# EAGLE design CFA (EAGLE 9.4.2)
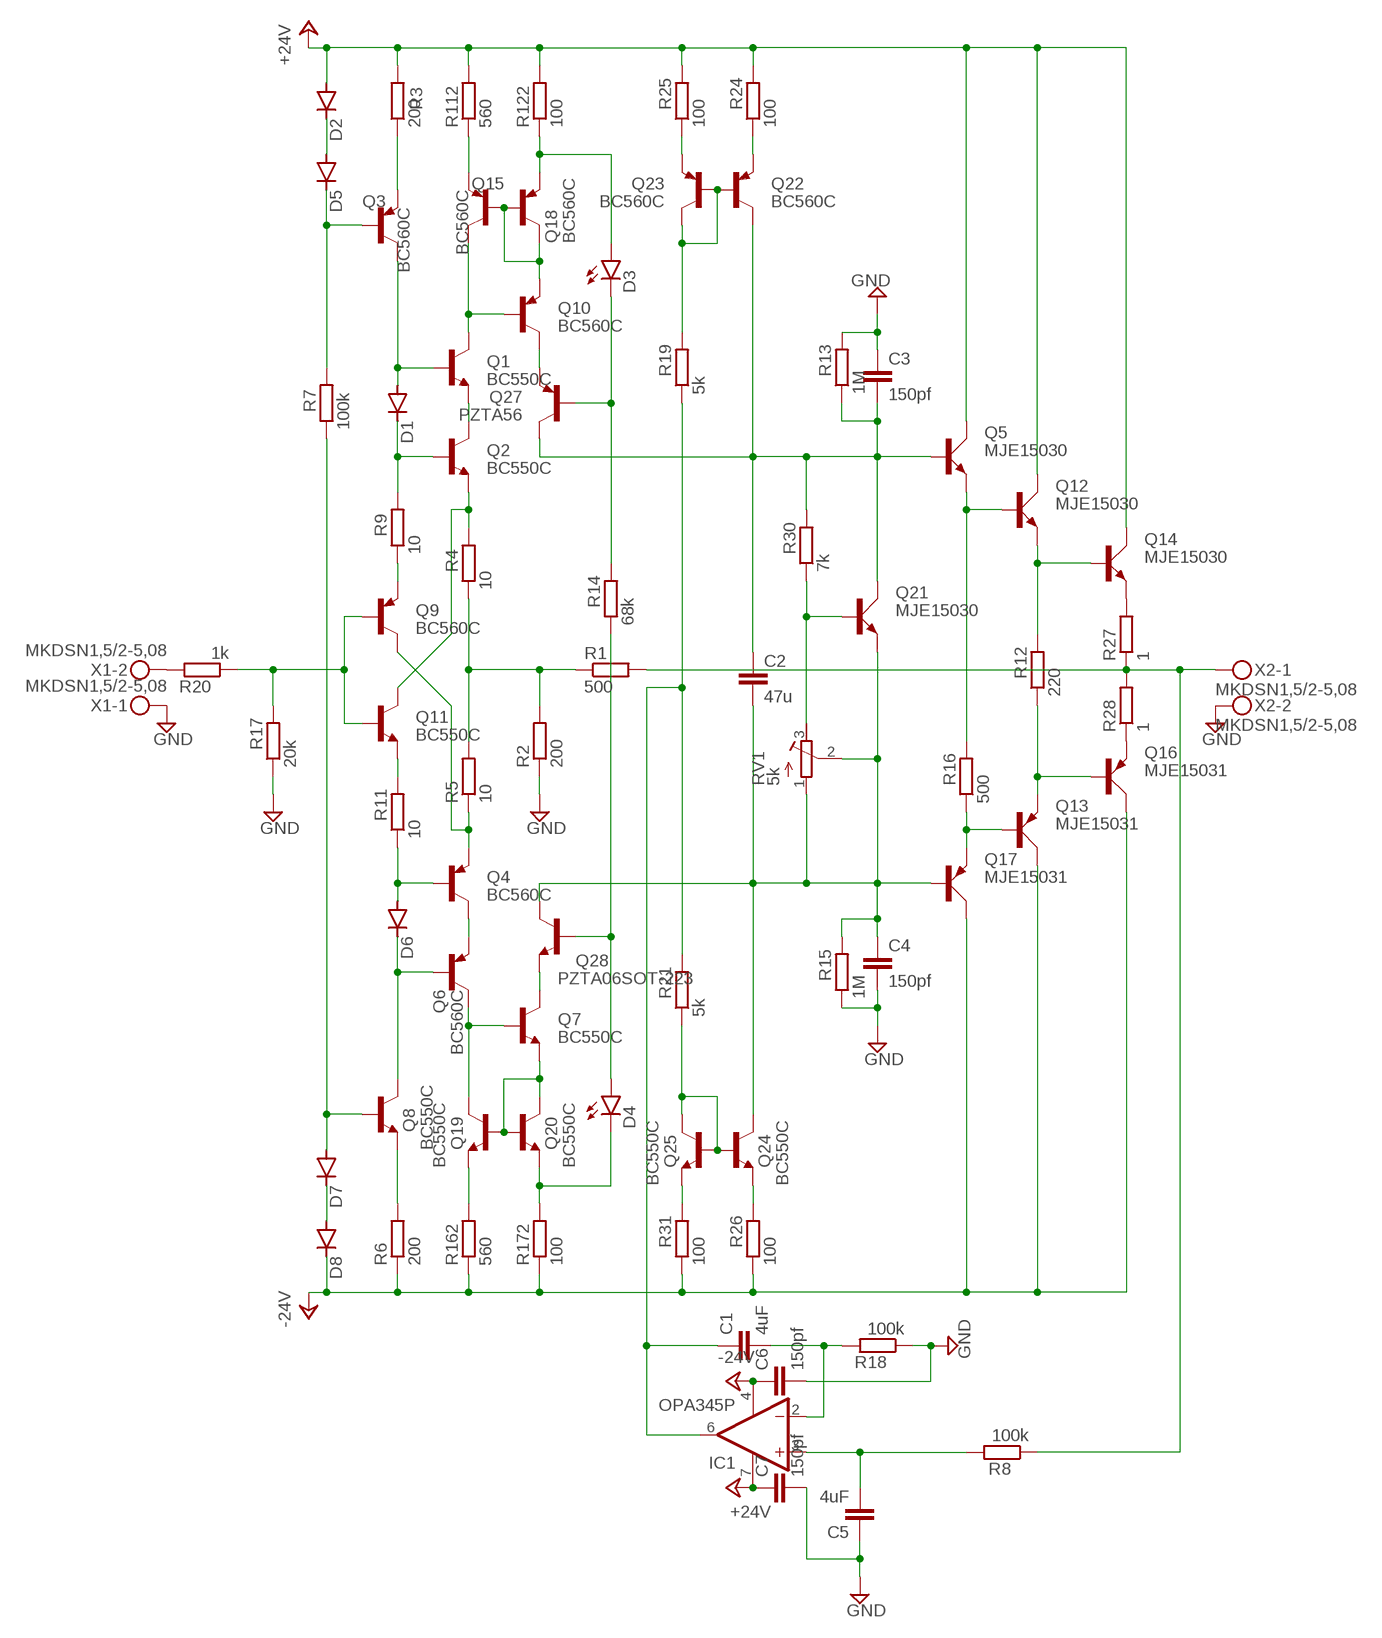
[diagram p0: schematic, sheet 1]

## Parts
C1  4uF  C-EUC1210  [C1210]
C2  47u  C-EUC1210  [C1210]
C3  150pf  C-EUC0805  [C0805]
C4  150pf  C-EUC0805  [C0805]
C5  4uF  C-EUC1210  [C1210]
C6  150pf  C-EUC0805  [C0805]
C7  150pf  C-EUC0805  [C0805]
D1  DIODE-SOD80C  [SOD80C]
D2  DIODE-SOD80C  [SOD80C]
D3  LED5MM  [LED5MM]
D4  LED5MM  [LED5MM]
D5  DIODE-SOD80C  [SOD80C]
D6  DIODE-SOD80C  [SOD80C]
D7  DIODE-SOD80C  [SOD80C]
D8  DIODE-SOD80C  [SOD80C]
IC1  OPA345P  [DIL08]
Q1  BC550C  [TO92-EBC]
Q2  BC550C  [TO92-EBC]
Q3  BC560C  [TO92-EBC]
Q4  BC560C  [TO92-EBC]
Q5  MJE15030  MJE3055  [TO220AV]
Q6  BC560C  [TO92-EBC]
Q7  BC550C  [TO92-EBC]
Q8  BC550C  [TO92-EBC]
Q9  BC560C  [TO92-EBC]
Q10  BC560C  [TO92-EBC]
Q11  BC550C  [TO92-EBC]
Q12  MJE15030  MJE3055  [TO220AV]
Q13  MJE15031  MJE2955  [TO220AV]
Q14  MJE15030  MJE3055  [TO220AV]
Q15  BC560C  [TO92-EBC]
Q16  MJE15031  MJE2955  [TO220AV]
Q17  MJE15031  MJE2955  [TO220AV]
Q18  BC560C  [TO92-EBC]
Q19  BC550C  [TO92-EBC]
Q20  BC550C  [TO92-EBC]
Q21  MJE15030  MJE3055  [TO220AV]
Q22  BC560C  [TO92-EBC]
Q23  BC560C  [TO92-EBC]
Q24  BC550C  [TO92-EBC]
Q25  BC550C  [TO92-EBC]
Q27  PZTA56  [SOT223]
Q28  PZTA06SOT-223  [SOT223]
R1  500  R-EU_MELF0204R  [MINI_MELF-0204R]
R2  200  R-EU_MELF0204R  [MINI_MELF-0204R]
R3  200  R-EU_MELF0204R  [MINI_MELF-0204R]
R4  10  R-EU_MELF0204R  [MINI_MELF-0204R]
R5  10  R-EU_MELF0204R  [MINI_MELF-0204R]
R6  200  R-EU_MELF0204R  [MINI_MELF-0204R]
R7  100k  R-EU_MELF0204R  [MINI_MELF-0204R]
R8  100k  R-EU_MELF0204R  [MINI_MELF-0204R]
R9  10  R-EU_MELF0204R  [MINI_MELF-0204R]
R11  10  R-EU_MELF0204R  [MINI_MELF-0204R]
R12  220  R-EU_MELF0204R  [MINI_MELF-0204R]
R13  1M  R-EU_MELF0204R  [MINI_MELF-0204R]
R14  68k  R-EU_MELF0204R  [MINI_MELF-0204R]
R15  1M  R-EU_MELF0204R  [MINI_MELF-0204R]
R16  500  R-EU_MELF0204R  [MINI_MELF-0204R]
R17  20k  R-EU_MELF0204R  [MINI_MELF-0204R]
R18  100k  R-EU_MELF0204R  [MINI_MELF-0204R]
R19  5k  R-EU_MELF0204R  [MINI_MELF-0204R]
R20  1k  R-EU_MELF0204R  [MINI_MELF-0204R]
R21  5k  R-EU_MELF0204R  [MINI_MELF-0204R]
R24  100  R-EU_MELF0204R  [MINI_MELF-0204R]
R25  100  R-EU_MELF0204R  [MINI_MELF-0204R]
R26  100  R-EU_MELF0204R  [MINI_MELF-0204R]
R27  1  R-EU_0617/22  [0617/22]
R28  1  R-EU_0617/22  [0617/22]
R30  7k  R-EU_MELF0204R  [MINI_MELF-0204R]
R31  100  R-EU_MELF0204R  [MINI_MELF-0204R]
R112  560  R-EU_MELF0204R  [MINI_MELF-0204R]
R122  100  R-EU_MELF0204R  [MINI_MELF-0204R]
R162  560  R-EU_MELF0204R  [MINI_MELF-0204R]
R172  100  R-EU_MELF0204R  [MINI_MELF-0204R]
RV1  5k  R-TRIMM3296W  [RTRIM3296W]
X1  MKDSN1,5/2-5,08  [MKDSN1,5/2-5,08]
X2  MKDSN1,5/2-5,08  [MKDSN1,5/2-5,08]

## Nets
+24V: C7.1 D2.A IC1.7(V+) Q5.C Q12.C Q14.C R3.2 R24.2 R25.2 R112.2 R122.2
-24V: C6.1 D8.C IC1.4(V-) Q13.C Q16.C Q17.C R6.1 R26.1 R31.1 R162.1 R172.1
GND: C3.1 C4.2 C5.1 C6.2 C7.2 R2.1 R13.2 R15.1 R17.1 R18.1 X1.1 X2.2
N$1: Q21.B R30.1 RV1.3(E)
N$2: Q3.E R3.1
N$3: D1.A Q1.B Q3.C
N$4: D2.C D5.A
N$5: D5.C Q3.B R7.2
N$6: D1.C Q2.B R9.2
N$7: Q1.E Q2.C
N$8: Q2.E Q11.C R4.2
N$9: R1.1 R2.2 R4.1 R5.2
N$10: Q4.E Q9.C R5.1
N$11: Q4.C Q6.E
N$12: D6.A Q4.B R11.1
N$13: D6.C Q6.B Q8.C
N$14: Q8.E R6.2
N$15: D7.A Q8.B R7.1
N$16: D7.C D8.A
N$17: R20.2 X1.2
N$19: Q9.E R9.1
N$20: Q11.E R11.2
N$21: Q15.E R112.1
N$22: Q9.B Q11.B R17.2 R20.1
N$23: Q1.C Q10.B Q15.C
N$24: Q10.E Q15.B Q18.B Q18.C
N$25: D3.A Q18.E R122.1
N$26: Q10.C Q27.3(E)
N$27: D3.K(C) Q27.1(B) R14.2
N$28: Q7.E Q19.B Q20.B Q20.C
N$29: D4.K(C) Q20.E R172.2
N$30: Q19.E R162.2
N$31: Q6.C Q7.B Q19.C
N$32: Q7.C Q28.3(E)
N$33: D4.A Q28.1(B) R14.1
N$35: Q12.E Q14.B R12.2
N$36: C2.1 C3.2 Q5.B Q21.C Q22.C Q27.2(C) Q27.4(C) R13.1 R30.2
N$37: Q22.B Q23.B Q23.C R19.2
N$38: Q24.B Q25.B Q25.C R21.1
N$39: Q23.E R25.1
N$40: Q22.E R24.1
N$41: C1.1 IC1.6(OUT) R19.1 R21.2
N$42: R1.2 R8.1 R27.1 R28.2 X2.1
N$43: Q25.E R31.2
N$44: Q24.E R26.2
N$45: Q5.E Q12.B R16.2
N$47: Q13.B Q17.E R16.1
N$48: C2.2 C4.1 Q17.B Q21.E Q24.C Q28.2(C) Q28.4(C) R15.2 RV1.1(A) RV1.2(S)
N$50: Q13.E Q16.B R12.1
N$51: Q14.E R27.2
N$52: Q16.E R28.1
N$53: C1.2 IC1.2(-IN) R18.2
N$55: C5.2 IC1.3(+IN) R8.2

## Library data of the parts
C1-C7 = Vwvwbg:C-EU: CAPACITOR, European symbol; SPICEPREFIX: C
D1 D2 D5-D8 = diode:DIODE-: DIODE; SPICEPREFIX: D
D3 D4 = led:LED: LED OSRAM: - CHIPLED LG R971, LG N971, LY N971, LG Q971, LY Q971, LO R971, LY R971 LH N974, LH R974 LS Q976, LO Q976, LY Q976 LO Q996 - Hyper CHIPLED LW Q18S LB Q993, LB Q99A, LB R99A - SideLED LS A670, LO A670, LY A670, LG A670, LP A670 LB A673, LV A673, LT A673, LW A673 LH A674 LY A675 LS A676, LA A676, LO A676, LY A676, LW A676 LS A679, LY A679, LG A679 - Hyper Micro SIDELED® LS Y876, LA Y876, LO Y876, LY Y876 LT Y87S - SmartLED LW L88C, LW L88S LB L89C, LB L89S, LG L890 LS L89K, LO L89K, LY L89K LS L896, LA L896, LO L896, LY L896 - TOPLED LS T670, LO T670, LY T670, LG T670, LP T670 LSG T670, LSP T670, LSY T670, LOP T670, LYG T670 LG T671, LOG T671, LSG T671 LB T673, LV T673, LT T673, LW T673 LH T674 LS T676, LA T676, LO T676, LY T676, LB T676, LH T676, LSB T676, LW T676 LB T67C, LV T67C, LT T67C, LS T67K, LO T67K, LY T67K, LW E67C LS E67B, LA E67B, LO E67B, LY E67B, LB E67C, LV E67C, LT E67C LW T67C LS T679, LY T679, LG T679 LS T770, LO T770, LY T770, LG T770, LP T770 LB T773, LV T773, LT T773, LW T773 LH T774 LS E675, LA E675, LY E675, LS T675 LS T776, LA T776, LO T776, LY T776, LB T776 LHGB T686 LT T68C, LB T68C - Hyper Mini TOPLED® LB M676 - Mini TOPLED Santana® LG M470 LS M47K, LO M47K, LY M47K Source: http://www.osram.convergy.de LUXEON: - LUMILED® LXK2-PW12-R00, LXK2-PW12-S00, LXK2-PW14-U00, LXK2-PW14-V00 LXK2-PM12-R00, LXK2-PM12-S00, LXK2-PM14-U00 LXK2-PE12-Q00, LXK2-PE12-R00, LXK2-PE12-S00, LXK2-PE14-T00, LXK2-PE14-U00 LXK2-PB12-K00, LXK2-PB12-L00, LXK2-PB12-M00, LXK2-PB14-N00, LXK2-PB14-P00, LXK2-PB14-Q00 LXK2-PR12-L00, LXK2-PR12-M00, LXK2-PR14-Q00, LXK2-PR14-R00 LXK2-PD12-Q00, LXK2-PD12-R00, LXK2-PD12-S00 LXK2-PH12-R00, LXK2-PH12-S00 LXK2-PL12-P00, LXK2-PL12-Q00, LXK2-PL12-R00 Source: www.luxeon.com KINGBRIGHT: KA-3528ASYC Source: www.kingbright.com; SPICEPREFIX: D
IC1 = linear:OPA*: Single Operational Amplifier Low Power, Single-Supply, Rail-To-Rail Operational Amplifier Source: http://focus.ti.com/lit/ds/symlink/opa2345.pdf; SPICEPREFIX: X
Q1 Q2 Q7 Q8 Q11 Q19 Q20 Q24 Q25 = transistor-npn:BC550*: NPN Transistor; SPICEPREFIX: Q
Q3 Q4 Q6 Q9 Q10 Q15 Q18 Q22 Q23 = transistor-pnp:BC560*: PNP Transistror; SPICEPREFIX: Q
Q5 Q12 Q14 Q21 = transistor-power:MJE3055: NPN TRANSISTOR; SPICEPREFIX: Q
Q13 Q16 Q17 = transistor-power:MJE2955: PNP TRANSISTOR; SPICEPREFIX: Q
Q27 = Vwvwbg:PZTA56; SPICEPREFIX: Q
Q28 = Vwvwbg:PZTA06; SPICEPREFIX: Q
R1-R9 R11-R21 R24-R28 R30 R31 R112 R122 R162 R172 = Vwvwbg:R-EU_: RESISTOR, European symbol; SPICEPREFIX: R
RV1 = resistor:R-TRIMM: Trimm resistor; SPICEPREFIX: Z
X1 X2 = con-phoenix-508:MKDSN1,5/2-5,08: MKDSN 1,5/ 2-5,08 Printklemme Nennstrom: 13,5 A Nennspannung: 250 V Rastermaß: 5,08 mm Polzahl: 2 Anschlussart: Schraubanschluss Montage: Löten Anschlussrichtung Leiter/Platine: 0 ° Artikelnummer: 1729128 Source: http://eshop.phoenixcontact.com .. 1729128.pdf

## Board
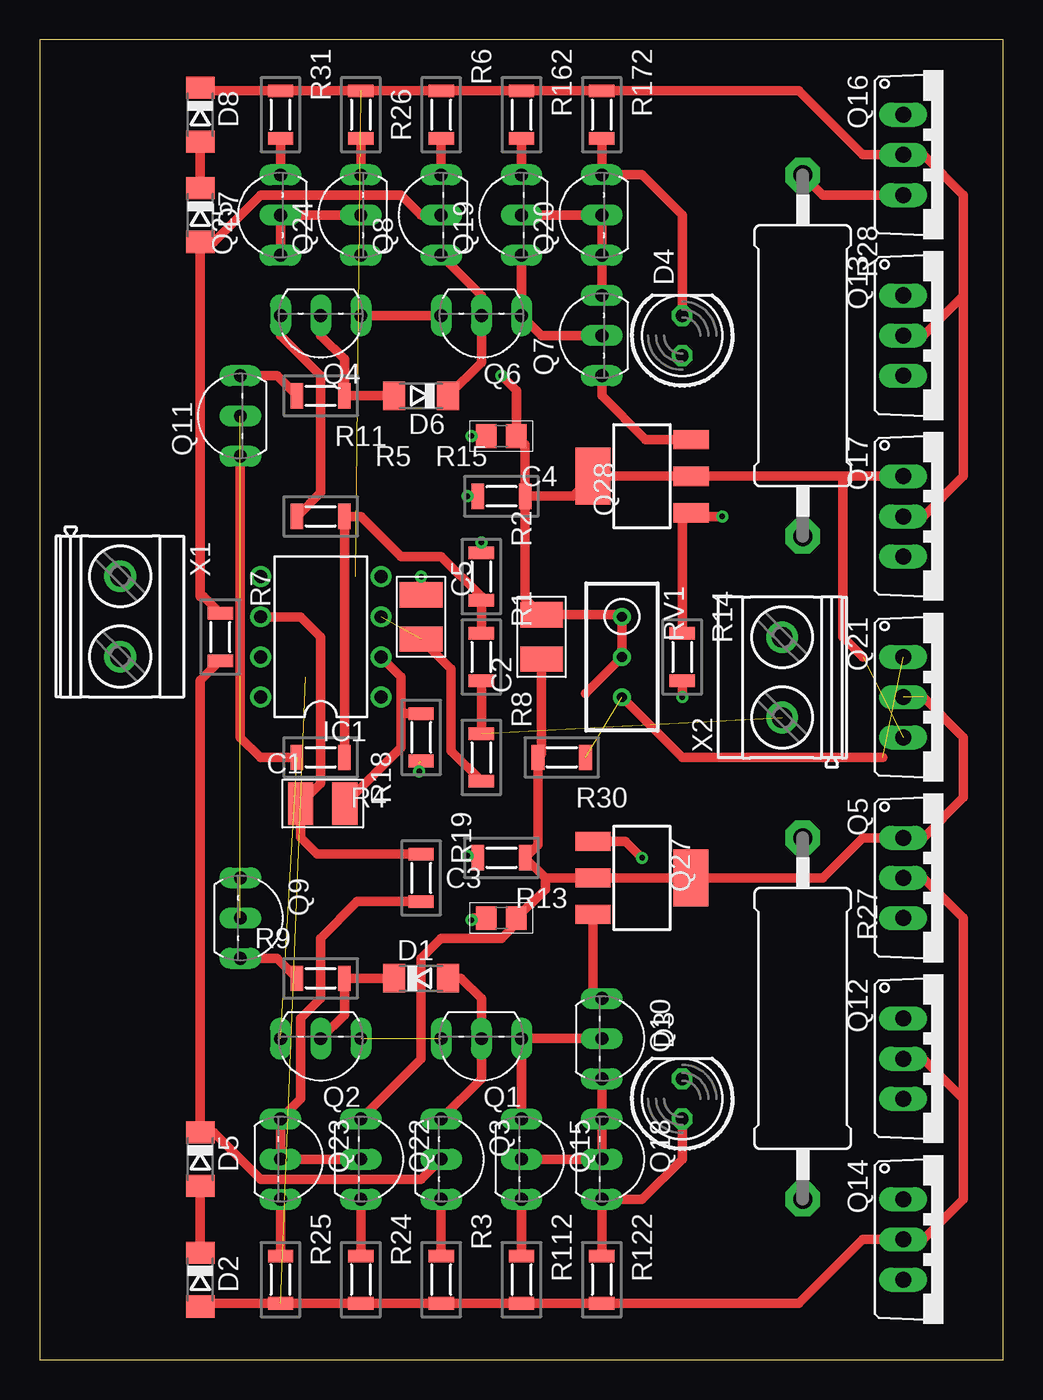
[diagram p1: board, top side]
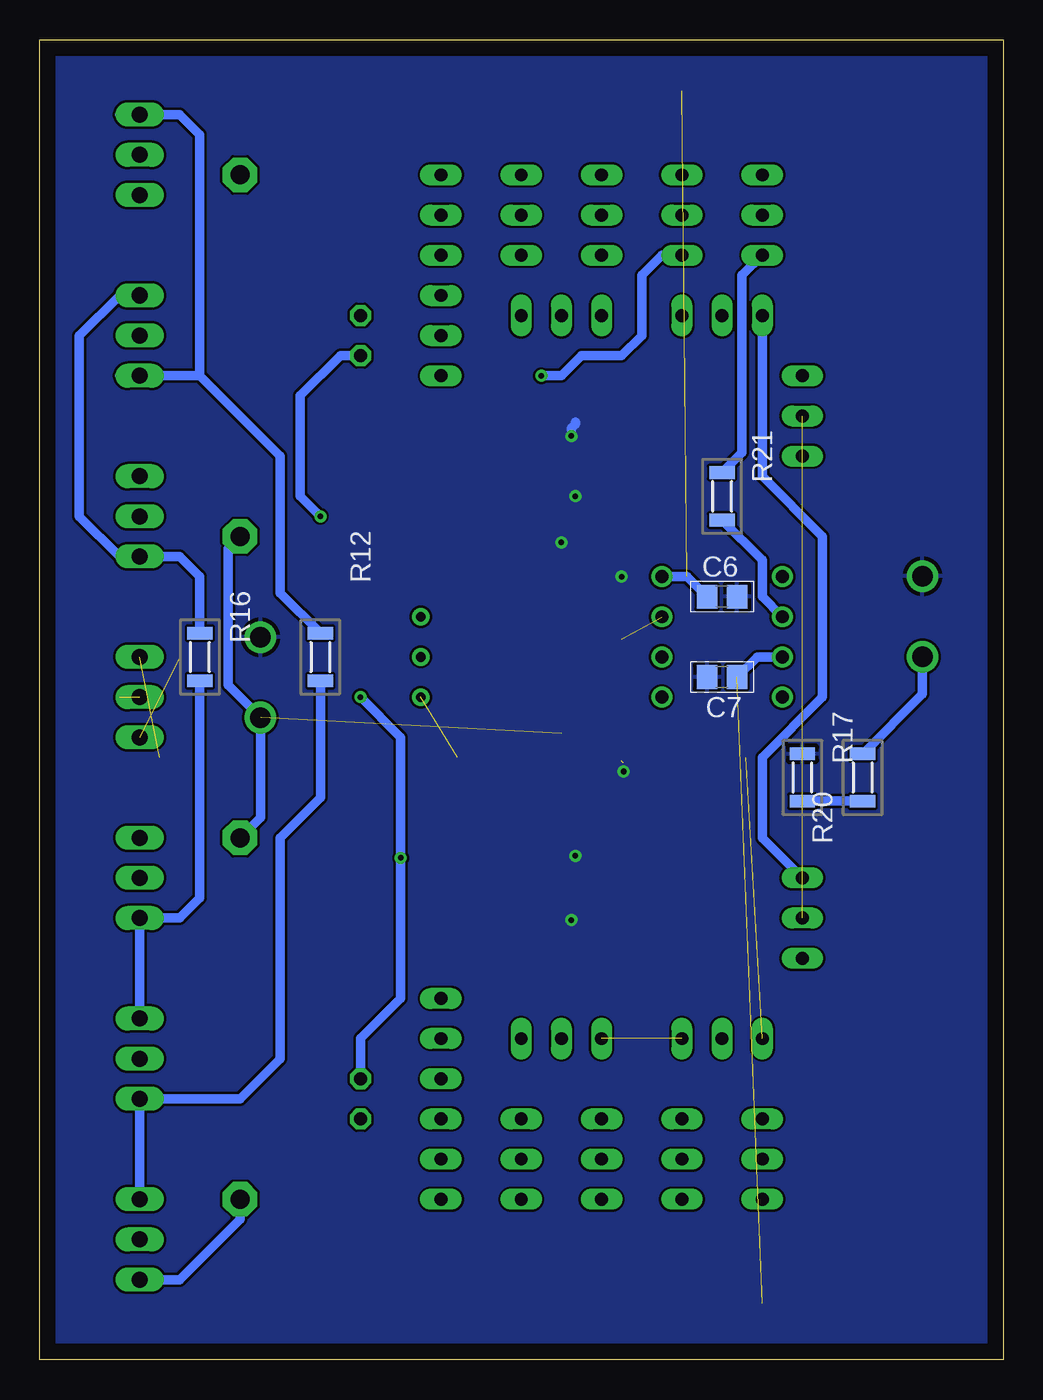
[diagram p2: board, bottom side, seen from below]

Size 60.94 x 83.49 mm. Coordinates in mm from the lower left corner, seen from the top.
Outline: 0,0 60.94,0 60.94,83.49 0,83.49 0,0
Copper layers (1*16): Top 0.035mm / dielectric 1.5mm / Bottom 0.035mm
Design rules "default": minimum track width 6mil, minimum drill 0.35mm, track to track 6mil, track to pad 6mil, pad to pad 6mil, via to via 6mil, smd to smd 6mil, copper to edge 40mil, drill to drill 6mil, minimum pad ring 10mil, minimum via ring 8mil, stop-mask expansion 4mil, vias tented up to drill 0mil, thermal gap 10mil

### Footprints (pad centres in the part's own frame; a part is rotated, then mirrored left to right if it is on the bottom)
C1210 = smd 1.6 x 2.7: 1 -1.4,0; 2 1.4,0
C0805 = smd 1.3 x 1.5: 1 -0.95,0; 2 0.95,0
SOD80C = smd 1.4 x 1.8: A 1.7,0; C -1.7,0
LED5MM = drill 0.813 octagon: A -1.27,0; K 1.27,0
DIL08 = drill 0.813 pad 1.27: 1 -3.81,-3.81; 2 -1.27,-3.81; 3 1.27,-3.81; 4 3.81,-3.81; 5 3.81,3.81; 6 1.27,3.81; 7 -1.27,3.81; 8 -3.81,3.81
TO92-EBC = drill 0.813 long: B 0,-1.27; C -2.54,-1.27; E 2.54,-1.27
TO220AV = drill 1.016 long: B -2.54,-2.54; C 0,-2.54; E 2.54,-2.54
SOT223 = smd 1.219 x 2.235: 1 -2.311,-3.099; 2 0,-3.099; 3 2.311,-3.099 | smd 3.6 x 2.2: 4 0,3.099
MINI_MELF-0204R = smd 0.8 x 1.6: 1 -1.5,0; 2 1.5,0
0617/22 = drill 1.2 pad 2.184 octagon: 1 -11.43,0; 2 11.43,0
RTRIM3296W = drill 0.61: 1 0,-2.54; 2 0,0; 3 0,2.54
MKDSN1,5/2-5,08 = drill 1.3 pad 2: 1 -2.561,0.025; 2 2.519,0.025

### Placement (x,y rotation side)
C1  17.91,35.18 0 top
C2  31.75,45.72 90 top
C3  29.21,27.94 0 top
C4  29.21,58.42 180 top
C5  24.13,46.99 270 top
C6  17.78,48.26 0 bottom
C7  17.78,43.18 180 bottom
D1  24.13,24.13 0 top
D2  10.16,5.08 270 top
D3  40.64,16.51 90 top
D4  40.64,64.77 90 top
D5  10.16,12.7 270 top
D6  24.13,60.96 180 top
D7  10.16,72.39 270 top
D8  10.16,78.74 270 top
IC1  17.78,45.72 90 top
Q1  27.94,19.05 180 top
Q2  17.78,19.05 180 top
Q3  26.67,12.7 270 top
Q4  17.78,64.77 180 top
Q5  57.15,30.48 270 top
Q6  27.94,64.77 180 top
Q7  34.29,64.77 90 top
Q8  24.13,72.39 90 top
Q9  13.97,27.94 270 top
Q10  36.83,20.32 270 top
Q11  11.43,59.69 90 top
Q12  57.15,19.05 270 top
Q13  57.15,64.77 270 top
Q14  57.15,7.62 270 top
Q15  31.75,12.7 270 top
Q16  57.15,76.2 270 top
Q17  57.15,53.34 270 top
Q18  36.83,12.7 270 top
Q19  29.21,72.39 90 top
Q20  34.29,72.39 90 top
Q21  57.15,41.91 270 top
Q22  21.59,12.7 270 top
Q23  16.51,12.7 270 top
Q24  19.05,72.39 90 top
Q25  13.97,72.39 90 top
Q27  38.1,30.48 270 top
Q28  38.1,55.88 90 top
R1  27.94,44.45 270 top
R2  27.94,49.53 270 top
R3  25.4,5.08 270 top
R4  17.78,38.1 180 top
R5  17.78,53.34 0 top
R6  25.4,78.74 270 top
R7  11.43,45.72 270 top
R8  27.94,38.1 270 top
R9  17.78,24.13 0 top
R11  17.78,60.96 180 top
R12  43.18,44.45 270 bottom
R13  29.21,31.75 180 top
R14  40.64,44.45 270 top
R15  29.21,54.61 0 top
R16  50.8,44.45 270 bottom
R17  12.7,36.83 270 bottom
R18  24.13,39.37 90 top
R19  24.13,30.48 270 top
R20  8.89,36.83 90 bottom
R21  17.78,54.61 270 bottom
R24  20.32,5.08 270 top
R25  15.24,5.08 270 top
R26  20.32,78.74 270 top
R27  48.26,21.59 270 top
R28  48.26,63.5 270 top
R30  33.02,38.1 180 top
R31  15.24,78.74 270 top
R112  30.48,5.08 270 top
R122  35.56,5.08 270 top
R162  30.48,78.74 270 top
R172  35.56,78.74 270 top
RV1  36.83,44.45 180 top
X1  5.08,46.99 270 top
X2  46.99,43.18 90 top

### Tracks (layer width: path | path; a pad name or v marks a point on that pad's centre or on a via)
+24V  (1 unrouted)
  Top 0.61: D2.A 10.36,3.58 R25.2 R24.2 R3.2 R112.2 R122.2 48.03,3.58 52.07,7.62 Q14.C 55.88,7.62 58.42,10.16 58.42,16.51 | Q12.C 55.88,19.05 58.42,16.51 | 58.42,16.51 58.42,27.94 55.88,30.48 Q5.C
  Bottom 0.61: C7.1 15.56,44.45 IC1.7
-24V  (1 unrouted)
  Top 0.61: D8.C 10.36,80.24 R31.1 R26.1 R6.1 R162.1 R172.1 48.03,80.24 52.07,76.2 Q16.C 55.88,76.2 58.42,73.66 58.42,67.31 | 58.42,67.31 55.88,64.77 Q13.C | 58.42,67.31 58.42,55.88 55.88,53.34 Q17.C
  Bottom 0.61: C6.1 20,49.53 IC1.4
GND  (via drill 0.35)  (1 unrouted)
  Top 0.61: C4.2 v27.3,58.42 | R15.1 v27.05,54.61 | R2.1 v27.94,51.69 | C5.1 v24.13,49.53 | 24,37.74 v24,37.21 | R13.2 27.58,31.88 v27.05,31.88 | C3.1 27.43,27.94 v27.3,27.81
  Bottom 0.61: v27.3,58.42 27.3,58.93 27.05,59.18 27.05,59.31
  pour Bottom: 0,88.9 60.96,88.9 60.96,-7.62 0,-7.62
N$1  (2 unrouted)
  Top 0.61: RV1.3 40.64,38.1 53.34,38.1
N$2
  Top 0.61: R3.1 Q3.E
N$3
  Top 0.61: Q3.C 27.94,17.78 Q1.B 27.94,22.86 26.67,24.13 D1.A
N$4
  Top 0.61: D5.A D2.C
N$5
  Top 0.61: R7.2 10.16,42.95 D5.C 11,14.4 13.97,11.43 24.13,11.43 Q3.B
N$6
  Top 0.61: Q2.B 19.28,21.82 R9.2 D1.C
N$7  (1 unrouted)
N$8  (1 unrouted)
  Top 0.61: R4.2 13.97,38.1 12.7,39.37 Q11.C
N$9
  Top 0.61: R1.1 R2.2 27.94,48.26 25.4,50.8 22.86,50.8 20.32,53.34 R5.2 R4.1
N$10
  Top 0.61: R5.1 17.78,54.84 17.78,62.23 15.24,64.77 Q4.E
  Bottom 0.61: Q9.C 15.24,33.02 15.24,38.1 11.43,41.91 11.43,52.07 15.24,55.88 Q4.E
N$11
  Top 0.61: Q6.E Q4.C
N$12
  Top 0.61: D6.A R11.1 19.28,63.27 17.78,64.77 Q4.B
N$13
  Top 0.61: D6.C 27.94,63.07 Q6.B 27.94,67.31 Q8.C
N$14
  Top 0.61: R6.2 Q8.E
N$15
  Top 0.61: R7.1 10.39,48.26 10.16,48.26 D7.A 11,70.69 13.97,73.66 22.86,73.66 24.13,72.39 Q8.B
N$16
  Top 0.61: D8.A D7.C
N$17
  Bottom 0.61: R20.2 5.11,42.12 X1.2
N$19
  Top 0.61: R9.1 15.01,25.4 Q9.E
N$20
  Top 0.61: R11.2 15.01,62.23 Q11.E
N$21
  Top 0.61: R112.1 Q15.E
N$22  (2 unrouted)
  Bottom 0.61: R17.2 R20.1
N$23
  Top 0.61: Q10.B Q1.C Q15.C
N$24
  Top 0.61: Q10.E Q18.C Q18.B Q15.B
N$25
  Top 0.61: R122.1 Q18.E 38.1,10.16 40.64,12.7 D3.A
N$26
  Top 0.61: Q10.C 35,23.42 Q27.3
N$27  (via drill 0.35)
  Top 0.61: R14.2 v40.64,41.91 | Q27.1 37.06,32.79 v38.1,31.75
  Bottom 0.61: D3.K 40.64,20.32 38.1,22.86 v38.1,31.75 38.1,39.37 v40.64,41.91
N$28
  Top 0.61: Q19.B Q20.B Q20.C Q7.E
N$29
  Top 0.61: R172.2 Q20.E 38.1,74.93 40.64,72.39 D4.K
N$30
  Top 0.61: R162.2 Q19.E
N$31
  Top 0.61: Q7.B 31.75,64.77 Q6.C Q19.C
N$32
  Top 0.61: Q28.3 38.33,58.19 35.56,60.96 Q7.C
N$33  (via drill 0.35)
  Top 0.61: R14.1 40.64,53.01 Q28.1 41.43,53.34 v43.18,53.34
  Bottom 0.61: v43.18,53.34 44.45,54.61 44.45,60.96 41.91,63.5 D4.A
N$35
  Bottom 0.61: R12.2 43.18,35.56 45.72,33.02 45.72,19.05 48.26,16.51 Q12.E Q14.B
N$36  (1 unrouted)
  Top 0.61: C2.1 31.75,38.33 R30.2 31.52,32.56 R13.1 31.98,30.48 | 31.98,30.48 Q27.2 Q27.4 49.53,30.48 52.07,33.02 Q5.B 55.88,33.02 58.42,35.56 58.42,39.37 55.88,41.91 | 31.98,30.48 31.98,29.76 C3.2 30.48,27.94 29.21,26.67 25.4,26.67 24.13,25.4 24.13,19.05 Q22.C
N$37
  Top 0.61: Q22.B Q23.B Q23.C 16.51,16.51 16.51,21.59 17.78,22.86 17.78,26.67 20.09,28.98 R19.2
N$38
  Top 0.61: Q24.B Q25.B Q25.C
  Bottom 0.61: R21.1 16.51,57.38 16.51,68.58 Q25.C
N$39
  Top 0.61: R25.1 Q23.E
N$40
  Top 0.61: R24.1 Q22.E
N$41
  Top 0.61: R19.1 17.55,31.98 16.51,33.02 C1.1 17.78,36.45 17.78,45.72 16.51,46.99 IC1.6
  Bottom 0.61: R21.2 15.24,50.57 15.24,48.26 IC1.6
N$42  (1 unrouted)
  Top 0.61: R8.1 R1.2
  Bottom 0.61: R27.1 46.97,34.31 X2.1 49.02,42.68 49.02,51.31 R28.2
N$43
  Top 0.61: Q25.E R31.2
N$44
  Top 0.61: R26.2 Q24.E
N$45
  Bottom 0.61: R16.2 50.8,29.21 52.07,27.94 Q5.E Q12.B
N$47
  Bottom 0.61: R16.1 50.8,49.53 52.07,50.8 Q17.E 55.88,50.8 58.42,53.34 58.42,64.77 55.88,67.31 Q13.B
N$48  (via drill 0.35)  (1 unrouted)
  Top 0.61: R15.2 33.73,54.61 Q28.4 Q28.2 50.8,55.88 | R15.2 30.71,57.87 C4.1 30.16,61.28 v29.21,62.23 | R15.2 30.71,48.16 C2.2 36.7,47.12 RV1.1 RV1.2 34.52,42.14 | 50.8,55.88 Q17.B | 52.07,44.45 50.8,45.72 50.8,55.88
  Bottom 0.61: v29.21,62.23 27.94,62.23 26.67,63.5 24.13,63.5 22.86,64.77 22.86,68.58 21.59,69.85 Q24.C
N$50
  Bottom 0.61: R12.1 45.72,48.49 45.72,57.15 50.8,62.23 | 50.8,62.23 Q13.E 55.88,62.23 | 55.88,78.74 Q16.B 52.07,78.74 50.8,77.47 50.8,62.23
N$51
  Bottom 0.61: Q14.E 52.07,5.08 48.26,8.89 R27.2
N$52
  Top 0.61: Q16.E 49.53,73.66 R28.1
N$53
  Top 0.61: 22.86,40.87 R18.2 | IC1.2 22.86,43.18 22.86,40.87 | C1.2 22.86,38.73 22.86,40.87
N$55  (1 unrouted)
  Top 0.61: R8.2 26.04,38.51 26.04,43.69 C5.2